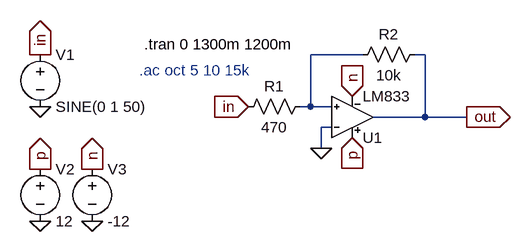
[diagram p0: schematic comparator-hysteresis.asc]
comparator-hysteresis.asc, the LTspice schematic file:
Version 4
SHEET 1 880 680
WIRE 352 208 272 208
WIRE 448 208 432 208
WIRE 272 288 272 208
WIRE 272 288 256 288
WIRE 304 288 272 288
WIRE 448 304 448 208
WIRE 448 304 368 304
WIRE 512 304 448 304
WIRE 304 320 288 320
WIRE 288 352 288 320
FLAG -144 288 0
FLAG -144 464 0
FLAG -64 464 0
FLAG -144 384 p
IOPIN -144 384 Out
FLAG -64 384 n
IOPIN -64 384 Out
FLAG 336 336 p
IOPIN 336 336 In
FLAG 336 272 n
IOPIN 336 272 In
FLAG -144 208 in
IOPIN -144 208 Out
FLAG 176 288 in
IOPIN 176 288 In
FLAG 288 352 0
FLAG 512 304 out
IOPIN 512 304 Out
SYMBOL Voltage -144 192 R0
SYMATTR InstName V1
SYMATTR Value SINE(0 1 50)
SYMATTR Value2 AC 1
SYMBOL Voltage -144 368 R0
SYMATTR InstName V2
SYMATTR Value 12
SYMBOL Voltage -64 368 R0
SYMATTR InstName V3
SYMATTR Value -12
SYMBOL Res 272 272 R90
WINDOW 0 0 56 VBottom 2
WINDOW 3 32 56 VTop 2
SYMATTR InstName R1
SYMATTR Value 470
SYMBOL Res 448 192 R90
WINDOW 0 0 56 VBottom 2
WINDOW 3 32 56 VTop 2
SYMATTR InstName R2
SYMATTR Value 10k
SYMBOL LM833 336 368 M180
SYMATTR InstName U1
TEXT 16 192 Left 2 !.tran 0 1300m 1200m
TEXT 8 232 Left 2 ;.ac oct 5 10 15k

The netlist it stands for:
* comparator-hysteresis.asc
V1 in 0 SINE(0 1 50) AC 1
V2 p 0 12
V3 n 0 -12
R1 N001 in 470
R2 out N001 10k
XU1 N001 0 p n out LM833  ; pins In+ In- V+ V- OUT
.tran 0 1300m 1200m
* .ac oct 5 10 15k
.lib LM833.sub
.backanno
.end